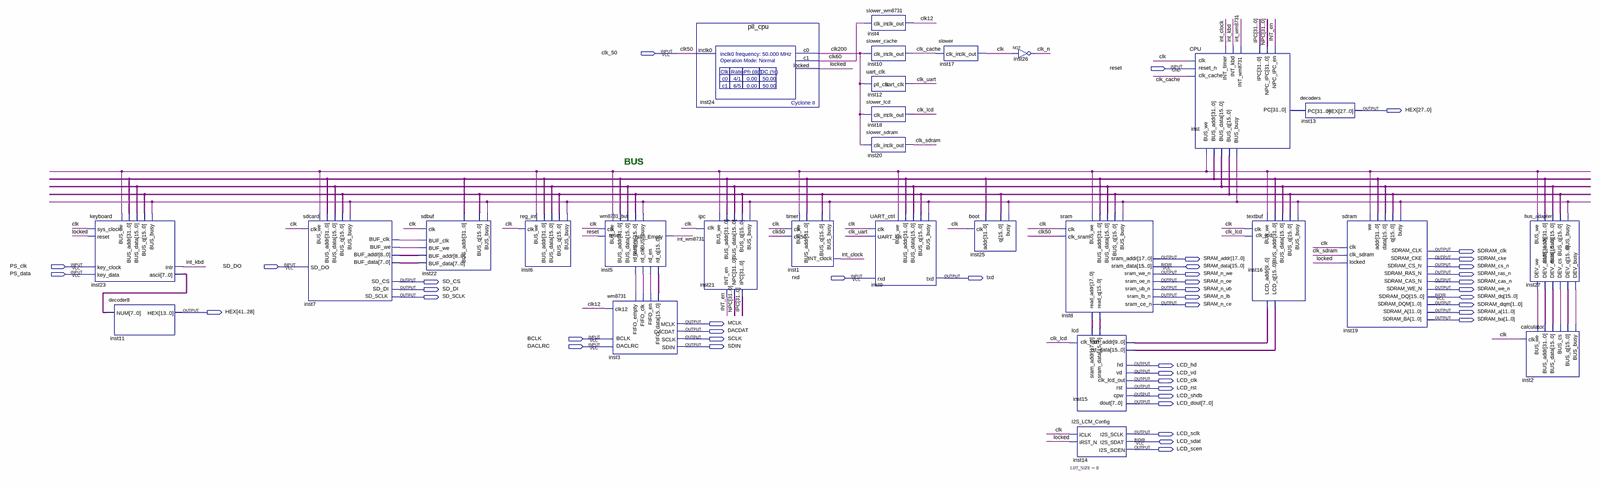
[diagram p0: schematic sheet, whole]
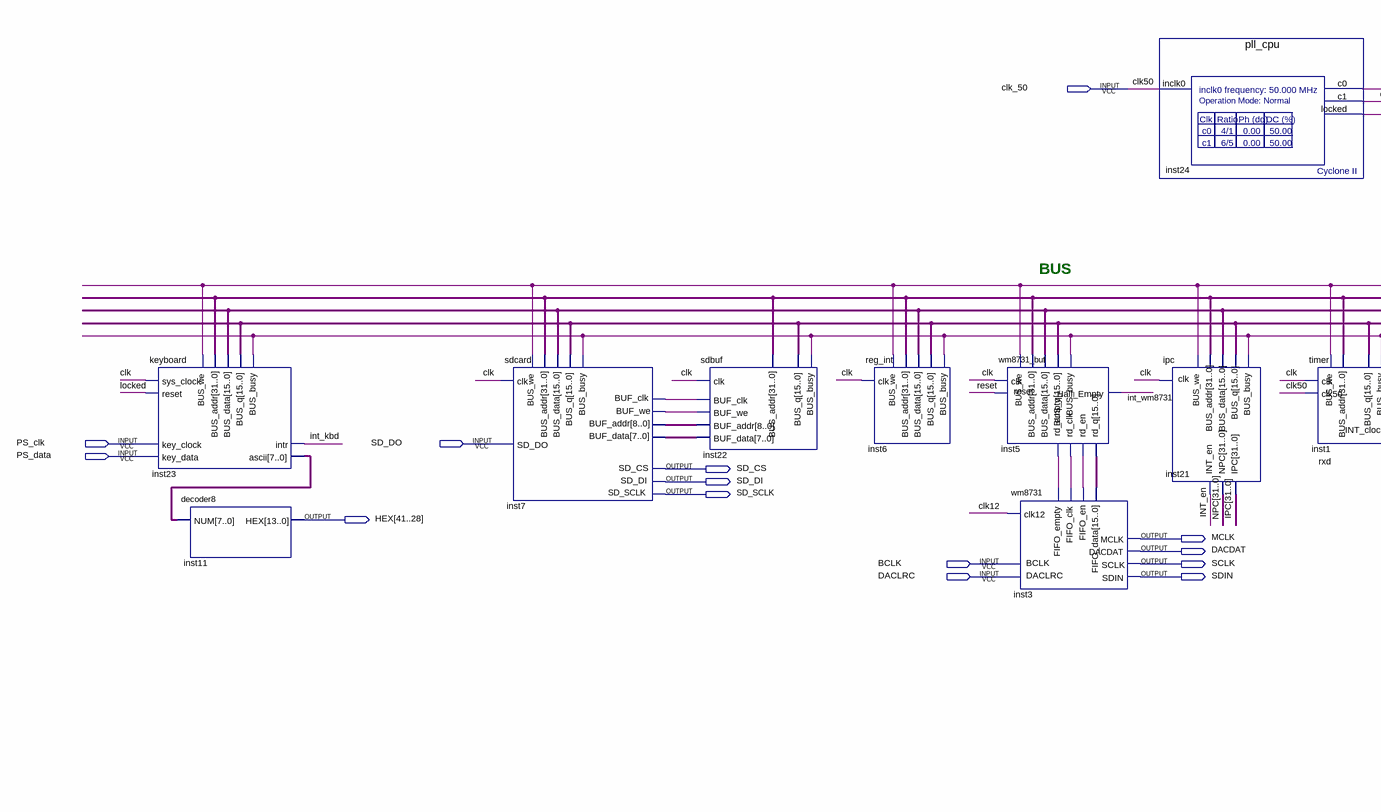
[diagram p1: schematic sheet, left part]
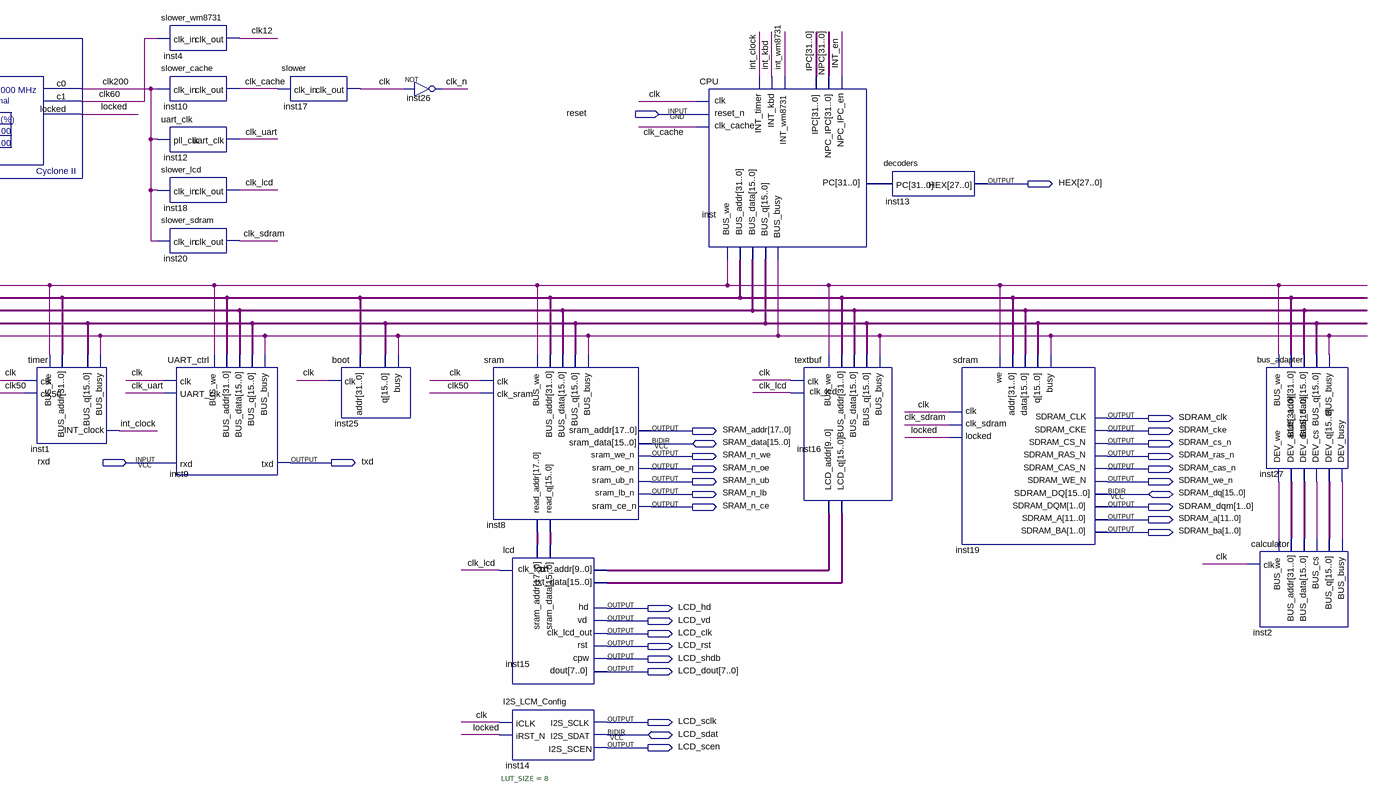
[diagram p2: schematic sheet, right part]
// Quartus schematic Computer1.bdf as structural Verilog: 28 symbols, 44 pins
module Computer1 (
  input  clk_50,
  input  reset,
  input  PS_clk,
  input  SD_DO,
  input  PS_data,
  input  rxd,
  input  BCLK,
  input  DACLRC,
  inout  [15:0] SRAM_data,
  inout  [15:0] SDRAM_dq,
  inout  LCD_sdat,
  output [41:0] HEX,
  output SDRAM_clk,
  output [17:0] SRAM_addr,
  output SDRAM_cke,
  output SDRAM_cs_n,
  output SRAM_n_we,
  output SDRAM_ras_n,
  output txd,
  output SD_CS,
  output SRAM_n_oe,
  output SDRAM_cas_n,
  output SD_DI,
  output SRAM_n_ub,
  output SDRAM_we_n,
  output SD_SCLK,
  output SRAM_n_lb,
  output SRAM_n_ce,
  output [1:0] SDRAM_dqm,
  output [11:0] SDRAM_a,
  output [1:0] SDRAM_ba,
  output MCLK,
  output DACDAT,
  output SCLK,
  output SDIN,
  output LCD_hd,
  output LCD_vd,
  output LCD_clk,
  output LCD_rst,
  output LCD_shdb,
  output [7:0] LCD_dout,
  output LCD_sclk,
  output LCD_scen
);

  wire clk, clk12, clk60, clk200, clk_cache, clk_lcd, clk_n, clk_sdram, clk_uart, inst2_bus_busy,
       inst2_bus_cs, inst3_fifo_clk, inst3_fifo_en, inst5_rd_empty, inst7_buf_clk, inst7_buf_we,
       inst23_bus_busy, inst27_dev_we, inst_bus_we, int_clock, INT_en, int_kbd, int_wm8731, locked;
  wire [7:0] inst7_buf_data, inst23_ascii;
  wire [8:0] inst7_buf_addr;
  wire [9:0] inst15_txt_addr;
  wire [15:0] inst2_bus_q, inst5_rd_q, inst8_read_q, inst16_lcd_q, inst23_bus_q, inst27_dev_data,
       inst_bus_data;
  wire [17:0] inst15_sram_addr;
  wire [31:0] inst27_dev_addr, inst_bus_addr, inst_pc, IPC, NPC;

  keyboard inst23 (
    .sys_clock(clk), .reset(locked), .BUS_we(inst_bus_we), .BUS_addr(inst_bus_addr),
    .BUS_data(inst_bus_data), .key_clock(PS_clk), .key_data(PS_data), .intr(int_kbd), .ascii(inst23_ascii),
    .BUS_q(inst23_bus_q), .BUS_busy(inst23_bus_busy));
  decoder8 inst11 (.NUM(inst23_ascii), .HEX(HEX[41:28]));
  sdcard inst7 (
    .clk(clk), .BUS_we(inst_bus_we), .BUS_addr(inst_bus_addr), .BUS_data(inst_bus_data), .SD_DO(SD_DO),
    .BUF_we(inst7_buf_we), .BUF_addr(inst7_buf_addr), .BUF_data(inst7_buf_data), .SD_CS(SD_CS),
    .SD_DI(SD_DI), .SD_SCLK(SD_SCLK), .BUF_clk(inst7_buf_clk), .BUS_q(inst23_bus_q),
    .BUS_busy(inst23_bus_busy));
  sdbuf inst22 (
    .clk(clk), .BUS_addr(inst_bus_addr), .BUF_clk(inst7_buf_clk), .BUF_we(inst7_buf_we),
    .BUF_addr(inst7_buf_addr), .BUF_data(inst7_buf_data), .BUS_q(inst23_bus_q), .BUS_busy(inst23_bus_busy));
  reg_int inst6 (
    .clk(clk), .BUS_we(inst_bus_we), .BUS_addr(inst_bus_addr), .BUS_data(inst_bus_data),
    .BUS_q(inst23_bus_q), .BUS_busy(inst23_bus_busy));
  wm8731_buf inst5 (
    .clk(clk), .BUS_addr(inst_bus_addr), .BUS_data(inst_bus_data), .rd_clk(inst3_fifo_clk),
    .rd_en(inst3_fifo_en), .reset(reset), .BUS_we(inst_bus_we), .Half_Empty(int_wm8731), .rd_q(inst5_rd_q),
    .rd_empty(inst5_rd_empty), .BUS_busy(inst23_bus_busy), .BUS_q(inst23_bus_q));
  wm8731 inst3 (
    .FIFO_data(inst5_rd_q), .BCLK(BCLK), .DACLRC(DACLRC), .clk12(clk12), .FIFO_empty(inst5_rd_empty),
    .FIFO_clk(inst3_fifo_clk), .FIFO_en(inst3_fifo_en), .MCLK(MCLK), .DACDAT(DACDAT), .SCLK(SCLK), .SDIN(SDIN));
  pll_cpu inst24 (.inclk0(clk_50), .c0(clk200), .c1(clk60), .locked(locked));
  ipc inst21 (
    .clk(clk), .BUS_we(inst_bus_we), .BUS_addr(inst_bus_addr), .BUS_data(inst_bus_data), .INT_en(INT_en),
    .NPC(NPC), .IPC(IPC), .BUS_q(inst23_bus_q), .BUS_busy(inst23_bus_busy));
  timer inst1 (
    .clk(clk), .BUS_addr(inst_bus_addr), .clk50(clk_50), .BUS_we(inst_bus_we), .INT_clock(int_clock),
    .BUS_q(inst23_bus_q), .BUS_busy(inst23_bus_busy));
  slower_wm8731 inst4 (.clk_in(clk60), .clk_out(clk12));
  slower_cache inst10 (.clk_in(clk200), .clk_out(clk_cache));
  uart_clk inst12 (.pll_clk(clk200), .uart_clk(clk_uart));
  slower_lcd inst18 (.clk_in(clk200), .clk_out(clk_lcd));
  slower_sdram inst20 (.clk_in(clk200), .clk_out(clk_sdram));
  UART_ctrl inst9 (
    .clk(clk), .UART_clk(clk_uart), .BUS_we(inst_bus_we), .BUS_addr(inst_bus_addr), .rxd(rxd),
    .BUS_data(inst_bus_data), .txd(txd), .BUS_busy(inst23_bus_busy), .BUS_q(inst23_bus_q));
  slower inst17 (.clk_in(clk_cache), .clk_out(clk));
  boot inst25 (.clk(clk), .addr(inst_bus_addr), .q(inst23_bus_q), .busy(inst23_bus_busy));
  not inst26 (clk_n, clk);
  sram inst8 (
    .clk(clk), .clk_sram(clk_50), .BUS_we(inst_bus_we), .BUS_addr(inst_bus_addr), .BUS_data(inst_bus_data),
    .read_addr(inst15_sram_addr), .read_q(inst8_read_q), .sram_addr(SRAM_addr), .sram_we_n(SRAM_n_we),
    .sram_oe_n(SRAM_n_oe), .sram_ub_n(SRAM_n_ub), .sram_lb_n(SRAM_n_lb), .sram_ce_n(SRAM_n_ce),
    .BUS_q(inst23_bus_q), .BUS_busy(inst23_bus_busy), .sram_data(SRAM_data));
  lcd inst15 (
    .sram_data(inst8_read_q), .txt_data(inst16_lcd_q), .clk_lcd(clk_lcd), .sram_addr(inst15_sram_addr),
    .hd(LCD_hd), .vd(LCD_vd), .rst(LCD_rst), .cpw(LCD_shdb), .dout(LCD_dout), .txt_addr(inst15_txt_addr),
    .clk_lcd_out(LCD_clk));
  I2S_LCM_Config #(.LUT_SIZE(8)) inst14 (
    .iCLK(clk), .iRST_N(locked), .I2S_SCLK(LCD_sclk), .I2S_SCEN(LCD_scen), .I2S_SDAT(LCD_sdat));
  CPU inst (
    .clk(clk), .clk_cache(clk_cache), .BUS_q(inst23_bus_q), .BUS_busy(inst23_bus_busy), .IPC(IPC),
    .reset_n(reset), .INT_timer(int_clock), .INT_kbd(int_kbd), .INT_wm8731(int_wm8731), .NPC_IPC(NPC),
    .NPC_IPC_en(INT_en), .PC(inst_pc), .BUS_we(inst_bus_we), .BUS_addr(inst_bus_addr),
    .BUS_data(inst_bus_data));
  textbuf inst16 (
    .clk(clk), .BUS_we(inst_bus_we), .BUS_addr(inst_bus_addr), .BUS_data(inst_bus_data),
    .LCD_addr(inst15_txt_addr), .clk_lcd(clk_lcd), .LCD_q(inst16_lcd_q), .BUS_q(inst23_bus_q),
    .BUS_busy(inst23_bus_busy));
  decoders inst13 (.PC(inst_pc), .HEX(HEX[27:0]));
  sdram inst19 (
    .clk(clk), .clk_sdram(clk_sdram), .locked(locked), .we(inst_bus_we), .addr(inst_bus_addr),
    .data(inst_bus_data), .SDRAM_CLK(SDRAM_clk), .SDRAM_CKE(SDRAM_cke), .SDRAM_CS_N(SDRAM_cs_n),
    .SDRAM_RAS_N(SDRAM_ras_n), .SDRAM_CAS_N(SDRAM_cas_n), .SDRAM_WE_N(SDRAM_we_n), .SDRAM_DQM(SDRAM_dqm),
    .SDRAM_A(SDRAM_a), .SDRAM_BA(SDRAM_ba), .q(inst23_bus_q), .busy(inst23_bus_busy), .SDRAM_DQ(SDRAM_dq));
  bus_adapter inst27 (
    .BUS_we(inst_bus_we), .BUS_addr(inst_bus_addr), .BUS_data(inst_bus_data), .DEV_cs(inst2_bus_cs),
    .DEV_q(inst2_bus_q), .DEV_busy(inst2_bus_busy), .DEV_we(inst27_dev_we), .DEV_addr(inst27_dev_addr),
    .DEV_data(inst27_dev_data), .BUS_q(inst23_bus_q), .BUS_busy(inst23_bus_busy));
  calculator inst2 (
    .clk(clk), .BUS_we(inst27_dev_we), .BUS_addr(inst27_dev_addr), .BUS_data(inst27_dev_data),
    .BUS_cs(inst2_bus_cs), .BUS_q(inst2_bus_q), .BUS_busy(inst2_bus_busy));

  // Other names for the same wires on the sheet: clk50 = clk_50

  // Notes on the sheet:
  //   BUS
endmodule
